# Altium schematic sheet UFl_calKit.SchDoc
size A4
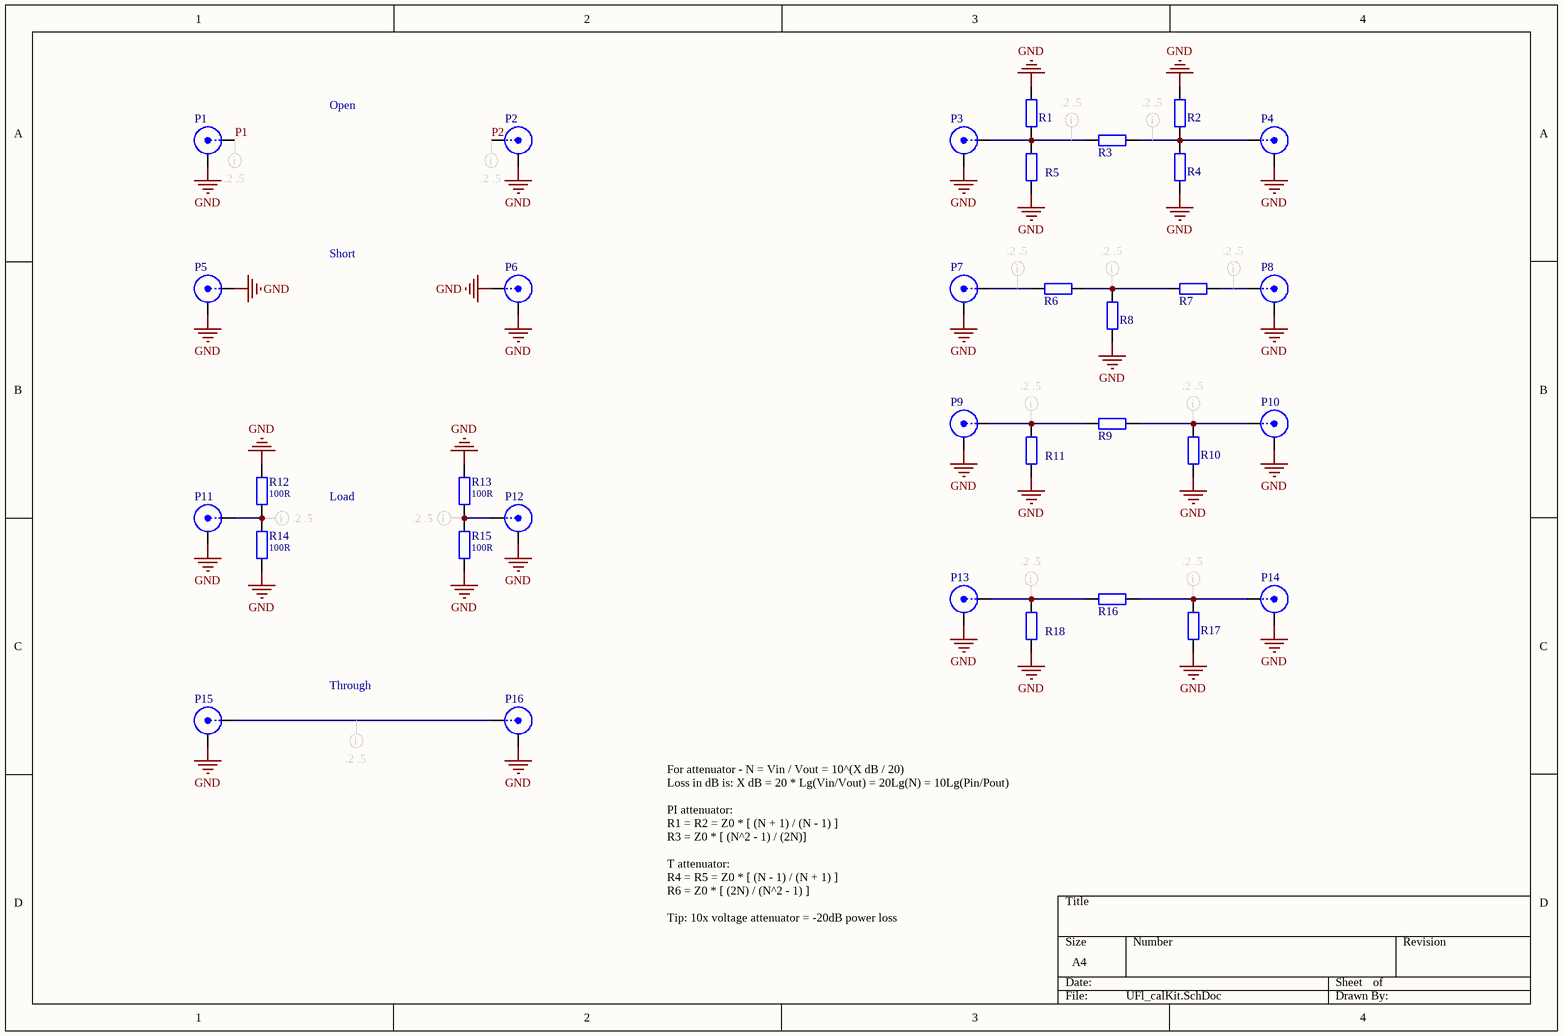
[diagram p0: UFl_calKit.SchDoc]

## Parts
P1  U.Fl.  [U.FL CalKit]  (value not drawn)
P2  U.Fl.  [U.FL CalKit]  (value not drawn)
P3  U.Fl.  [U.FL CalKit]  (value not drawn)
P4  U.Fl.  [U.FL CalKit]  (value not drawn)
P5  U.Fl.  [U.FL-R-SMT-1(10)]  (value not drawn)
P6  U.Fl.  [U.FL-R-SMT-1(10)]  (value not drawn)
P7  U.Fl.  [U.FL CalKit]  (value not drawn)
P8  U.Fl.  [U.FL CalKit]  (value not drawn)
P9  U.Fl.  [U.FL CalKit]  (value not drawn)
P10  U.Fl.  [U.FL CalKit]  (value not drawn)
P11  U.Fl.  [U.FL CalKit]  (value not drawn)
P12  U.Fl.  [U.FL CalKit]  (value not drawn)
P13  U.Fl.  [U.FL CalKit]  (value not drawn)
P14  U.Fl.  [U.FL CalKit]  (value not drawn)
P15  U.Fl.  [U.FL CalKit]  (value not drawn)
P16  U.Fl.  [U.FL CalKit]  (value not drawn)
R1  0R, 50 V, 0402, 62.5 mW, ± 1%  [C SMD ceramic 0402 RF with silkscreen]  (value not drawn)  (no BOM)
R2  0R, 50 V, 0402, 62.5 mW, ± 1%  [C SMD ceramic 0402 RF with silkscreen]  (value not drawn)  (no BOM)
R3  0R, 50 V, 0402, 62.5 mW, ± 1%  [C SMD ceramic 0402 RF with silkscreen]  (value not drawn)  (no BOM)
R4  0R, 50 V, 0402, 62.5 mW, ± 1%  [C SMD ceramic 0402 RF with silkscreen]  (value not drawn)  (no BOM)
R5  0R, 50 V, 0402, 62.5 mW, ± 1%  [C SMD ceramic 0402 RF with silkscreen]  (value not drawn)  (no BOM)
R6  0R, 50 V, 0402, 62.5 mW, ± 1%  [WE Match B]  (value not drawn)  (no BOM)
R7  0R, 50 V, 0402, 62.5 mW, ± 1%  [WE Match B]  (value not drawn)  (no BOM)
R8  0R, 50 V, 0402, 62.5 mW, ± 1%  [WE Match B]  (value not drawn)  (no BOM)
R9  0R, 50 V, 0402, 62.5 mW, ± 1%  [WE Match B]  (value not drawn)  (no BOM)
R10  0R, 50 V, 0402, 62.5 mW, ± 1%  [WE Match B]  (value not drawn)  (no BOM)
R11  0R, 50 V, 0402, 62.5 mW, ± 1%  [WE Match B]  (value not drawn)  (no BOM)
R12  value 100R  [C SMD ceramic 0402 RF]  (hidden comment: 100R, 50 V, 0402, 62.5 mW, ± 1%)
R13  value 100R  [C SMD ceramic 0402 RF]  (hidden comment: 100R, 50 V, 0402, 62.5 mW, ± 1%)
R14  value 100R  [C SMD ceramic 0402 RF]  (hidden comment: 100R, 50 V, 0402, 62.5 mW, ± 1%)
R15  value 100R  [C SMD ceramic 0402 RF]  (hidden comment: 100R, 50 V, 0402, 62.5 mW, ± 1%)
R16  0R, 50 V, 0402, 62.5 mW, ± 1%  [WE Match B]  (value not drawn)  (no BOM)
R17  0R, 50 V, 0402, 62.5 mW, ± 1%  [WE Match B]  (value not drawn)  (no BOM)
R18  0R, 50 V, 0402, 62.5 mW, ± 1%  [WE Match B]  (value not drawn)  (no BOM)

## Nets
GND: P1.2(Y) P2.2(Y) P3.2(Y) P4.2(Y) P5.1(X) P5.2(Y) P6.1(X) P6.2(Y) P7.2(Y) P8.2(Y) P9.2(Y) P10.2(Y) P11.2(Y) P12.2(Y) P13.2(Y) P14.2(Y) P15.2(Y) P16.2(Y) R1.2 R2.2 R4.2 R5.2 R8.2 R10.2 R11.2 R12.1 R13.1 R14.1 R15.1 R17.2 R18.2
P1: P1.1(X)
P2: P2.1(X)
NetP3_1: P3.1(X) R1.1 R3.2 R5.1
NetP4_1: P4.1(X) R2.1 R3.1 R4.1
NetP7_1: P7.1(X) R6.1
NetP8_1: P8.1(X) R7.2
NetP9_1: P9.1(X) R9.2 R11.1
NetP10_1: P10.1(X) R9.1 R10.1
NetP11_1: P11.1(X) R12.2 R14.2
NetP12_1: P12.1(X) R13.2 R15.2
NetP13_1: P13.1(X) R16.2 R18.1
NetP14_1: P14.1(X) R16.1 R17.1
NetP15_1: P15.1(X) P16.1(X)
NetR6_2: R6.2 R7.1 R8.1

## Layout directives
rule Clearance Constraint [Generic clearance = 0.2mm, and 9 value(s) for objects]: NetP3_1, NetP4_1, NetP7_1, NetP8_1, NetP9_1, NetP10_1, NetP11_1, NetP12_1, NetP13_1, NetP14_1, NetP15_1, NetR6_2, P1, P2

## Notes on the sheet
- Open
- Short
- Load
- Through
- For attenuator - N = Vin / Vout = 10^(X dB / 20)
  Loss in dB is: X dB = 20 * Lg(Vin/Vout) = 20Lg(N) = 10Lg(Pin/Pout)
  PI attenuator:
  R1 = R2 = Z0 * [ (N + 1) / (N - 1) ]
  R3 = Z0 * [ (N^2 - 1) / (2N)]
  T attenuator:
  R4 = R5 = Z0 * [ (N - 1) / (N + 1) ]
  R6 = Z0 * [ (2N) / (N^2 - 1) ]
  Tip: 10x voltage attenuator = -20dB power loss

## Library data of the parts
P1-P16 = BNC
R1-R11 R16-R18 = Resistor: Part Number: 0402WGJ0000TCE; Manufacturer: ROYAL OHM; Value: Do Not Mount; Price 1: 0.00849; Price 100: 0.00849; Price 1000: 0.00228
R12-R15 = Resistor: Part Number: AC0402FR-10100RL; Manufacturer: YAGEO; Price 1: 0.085; Price 100: 0.005; Price 1000: 0.004